# Altium schematic sheet Sheet3.SchDoc
size A
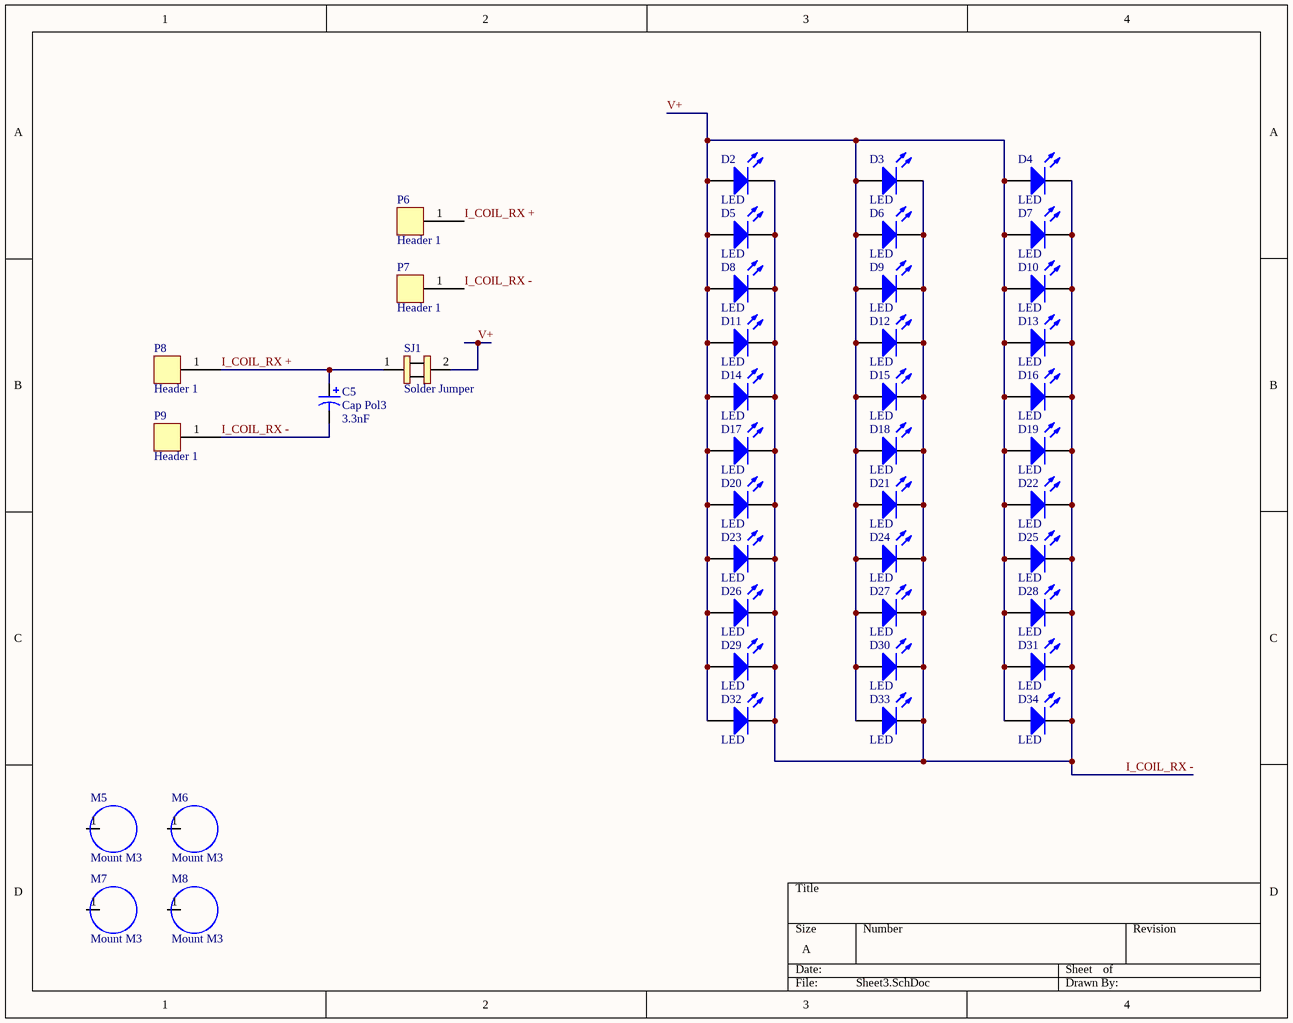
[diagram p0: Sheet3.SchDoc]

## Parts
C5  Cap Pol3  value 3.3nF  [C0805]
D2  LED  [0805]
D3  LED  [0805]
D4  LED  [0805]
D5  LED  [0805]
D6  LED  [0805]
D7  LED  [0805]
D8  LED  [0805]
D9  LED  [0805]
D10  LED  [0805]
D11  LED  [0805]
D12  LED  [0805]
D13  LED  [0805]
D14  LED  [0805]
D15  LED  [0805]
D16  LED  [0805]
D17  LED  [0805]
D18  LED  [0805]
D19  LED  [0805]
D20  LED  [0805]
D21  LED  [0805]
D22  LED  [0805]
D23  LED  [0805]
D24  LED  [0805]
D25  LED  [0805]
D26  LED  [0805]
D27  LED  [0805]
D28  LED  [0805]
D29  LED  [0805]
D30  LED  [0805]
D31  LED  [0805]
D32  LED  [0805]
D33  LED  [0805]
D34  LED  [0805]
M5  Mount M3  [M3]
M6  Mount M3  [M3]
M7  Mount M3  [M3]
M8  Mount M3  [M3]
P6  Header 1  [Pad]
P7  Header 1  [Pad]
P8  Header 1  [Pad]
P9  Header 1  [Pad]
SJ1  Solder Jumper

## Nets
I_COIL_RX +: C5.1 P6.1 P8.1 SJ1.1
I_COIL_RX -: C5.2 D2.2(K) D3.2(K) D4.2(K) D5.2(K) D6.2(K) D7.2(K) D8.2(K) D9.2(K) D10.2(K) D11.2(K) D12.2(K) D13.2(K) D14.2(K) D15.2(K) D16.2(K) D17.2(K) D18.2(K) D19.2(K) D20.2(K) D21.2(K) D22.2(K) D23.2(K) D24.2(K) D25.2(K) D26.2(K) D27.2(K) D28.2(K) D29.2(K) D30.2(K) D31.2(K) D32.2(K) D33.2(K) D34.2(K) P7.1 P9.1
V+: D2.1(A) D3.1(A) D4.1(A) D5.1(A) D6.1(A) D7.1(A) D8.1(A) D9.1(A) D10.1(A) D11.1(A) D12.1(A) D13.1(A) D14.1(A) D15.1(A) D16.1(A) D17.1(A) D18.1(A) D19.1(A) D20.1(A) D21.1(A) D22.1(A) D23.1(A) D24.1(A) D25.1(A) D26.1(A) D27.1(A) D28.1(A) D29.1(A) D30.1(A) D31.1(A) D32.1(A) D33.1(A) D34.1(A) SJ1.2

Not connected (* = marked no-connect by the designer): M5 1; M6 1; M7 1; M8 1

## Library data of the parts
C5 = Cap Pol3: Polarized Capacitor (Surface Mount); Published: 8-Jun-2000; LatestRevisionDate: 29-May-2009; LatestRevisionNote: IPC-7351 Footprint Added.; PackageReference: C0805; Publisher: Altium Limited; PackageDescription: Chip Capacitor
D2-D34 = LED1: Typical RED GaAs LED; Published: 8-Jun-2000; LatestRevisionDate: 08-Jul-2005; LatestRevisionNote: Mech Layer 1 removed.; PackageReference: LED-1; Publisher: Altium Limited; PackageDescription: LED; 2 Leads